# EAGLE schematic gun_fan (EAGLE 9.2.0)
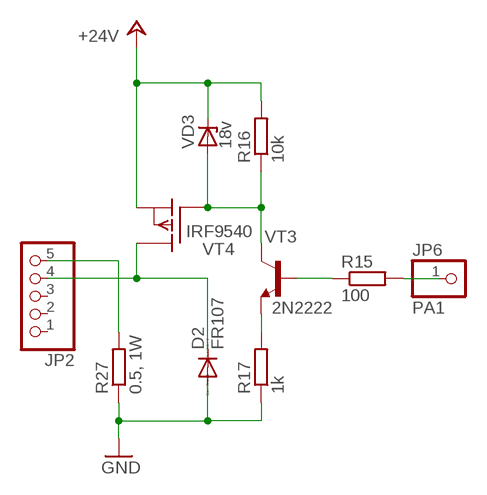
[diagram p0: schematic, sheet 1]

## Parts
D2  FR107  1N4004  [DO41-10]
JP2  PINHD-1X5  [1X05]
JP6  PA1  PINHD-1X1  [1X01]
R15  100  R-EU_0207/10  [0207/10]
R16  10k  R-EU_0207/10  [0207/10]
R17  1k  R-EU_0207/10  [0207/10]
R27  0.5, 1W  R-EU_0207/10  [0207/10]
VD3  18v  ZENER-DIODEC1702-15  [C1702-15]
VT3  2N2222  [TO18]
VT4  IRF9540  IRF9530  [TO220]

## Nets
+24V: R16.2 VD3.C VT4.3(S)
GND: D2.A R17.1 R27.1
N$1: JP2.5 R27.2
N$2: D2.C JP2.4 VT4.2(D)
N$4: R16.1 VD3.A VT3.3(C) VT4.1(G)
N$7: R17.2 VT3.1(E)
N$8: R15.1 VT3.2(B)
N$9: JP6.1 R15.2
Unconnected: JP2.1 JP2.2 JP2.3

## Library data of the parts
D2 = diode:1N4004: DIODE general purpose rectifier, 1 A
JP2 = pinhead:PINHD-1X5: PIN HEADER
JP6 = pinhead:PINHD-1X1: PIN HEADER
R15-R17 R27 = rcl:R-EU_: RESISTOR, European symbol; SPICEPREFIX: R
VD3 = diode:ZENER-DIODE: Z-Diode
VT3 = transistor:2N2222: NPN TRANSISTOR
VT4 = transistor-fet:IRF9530: P-Channel Enhancement MOSFET (HEXFET); -100V; -12A; 0,3Ohm